# Altium schematic sheet LPCB222 - LINEAR POT.SchDoc
size A3; Address1: Factory 10; Address2: 9-13 Dingley Avenue, Dandeong, VICTORIA 3175, AUSTRALIA; DocumentNumber: 2; Revision: 1; SheetNumber: 2; SheetTotal: 3; Lockie__PCB_SUB_ASSEMBLY: Linear Pot; Lockie__PCB_ASSEMBLY: Gimbal Interface; Lockie__LDL: LPCB222; Lockie__PCB_DESCRIPTION: Gimbal Interface
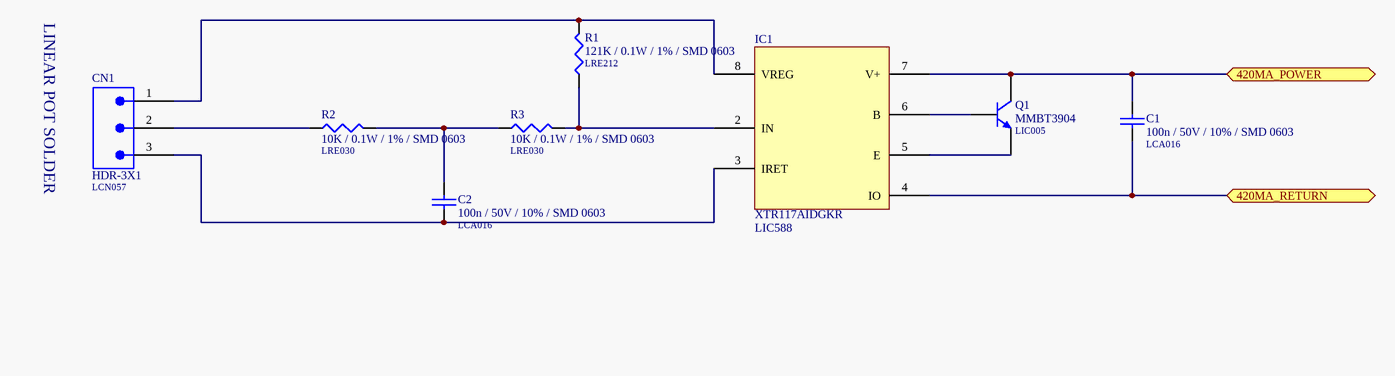
[diagram p0: LPCB222 - LINEAR POT.SchDoc]

## Parts
C1  100n / 50V / 10% / SMD 0603  LDL_NUMBER: LCA016  [LFP011__CC1608-0603-IPC7351_B]
C2  100n / 50V / 10% / SMD 0603  LDL_NUMBER: LCA016  [LFP011__CC1608-0603-IPC7351_B]
CN1  HDR-3X1  LDL_NUMBER: LCN057  [HDR-3X1]  (no BOM)
IC1  XTR117AIDGKR  LDL_NUMBER: LIC588  [LFP015__UMAX8]
Q1  MMBT3904  LDL_NUMBER: LIC005  [LFP021__SOT23]
R1  121K / 0.1W / 1% / SMD 0603  LDL_NUMBER: LRE212  [LFP020__CR1608-0603-IPC7351_B]
R2  10K / 0.1W / 1% / SMD 0603  LDL_NUMBER: LRE030  [LFP020__CR1608-0603-IPC7351_B]
R3  10K / 0.1W / 1% / SMD 0603  LDL_NUMBER: LRE030  [LFP020__CR1608-0603-IPC7351_B]

## Ports
420MA_POWER (bidir), 420MA_RETURN (bidir)

## Nets
420MA_POWER: C1.1 IC1.7(V+) Q1.3(C) ; port 420MA_POWER
420MA_RETURN: C1.2 IC1.4(IO) ; port 420MA_RETURN
NetC2_1: C2.1 R2.2 R3.1
NetC2_2: C2.2 CN1.3 IC1.3(IRET)
NetCN1_1: CN1.1 IC1.8(VREG) R1.2
NetCN1_2: CN1.2 R2.1
NetIC1_2: IC1.2(IN) R1.1 R3.2
NetIC1_5: IC1.5(E) Q1.2(E)
NetIC1_6: IC1.6(B) Q1.1(B)

## Notes on the sheet
- LINEAR POT SOLDER
- PCB COMPONENT DESCRIPTION
- LDL NUMBER
- Assembly Details
- Size
- Drawing File Name
- Revision
- http://rloop.org
- Scale
- A3
- Sheet Details
- N.T.S
- Sheet:
- Of:

## Library data of the parts
C1 C2 = 100n / 50V / 10% / SMD 0603: Capacitor, Ceramic Chip, 100nF (0.1uF), 50V, 5%, SMD 0603 [LCA016]; FMEDA__OPERATING__VOLTAGE_MIN: 0; FMEDA__OPERATING__VOLTAGE_MAX: 3.3; FMEDA__OPERATING__TEMP_MIN: -20; FMEDA__OPERATING__TEMP_TYP: 27; FMEDA__OPERATING__TEMP_MAX: 50; FMEDA__CHANNEL: COM; Value: 100n; FMEDA__FUNCTION_IN_SYSTEM: *; FMEDA__OPERATING__VOLTAGE_TYP: 3.3
CN1 = HDR-3X1: Header, 2.54mm (0.1in), 3 Pins x 1 Row (40 Per Row In Strip); FMEDA__CHANNEL: COM; FMEDA__OPERATING__CURRENT_MAX: 0; FMEDA__OPERATING__TEMP_MAX: 50; FMEDA__OPERATING__TEMP_MIN: -20; FMEDA__OPERATING__TEMP_TYP: 27; FMEDA__OPERATING__VOLTAGE_MAX: 16; FMEDA__OPERATING__VOLTAGE_TYP: 12; FMEDA__FUNCTION_IN_SYSTEM: *; FMEDA__OPERATING__CURRENT_MIN: 0; FMEDA__OPERATING__CURRENT_TYP: 0; FMEDA__OPERATING__VOLTAGE_MIN: 0
IC1 = XTR117AIDGKR: IC, 4-20mA Current Loop Transmitter, SMD SOIC8 [LIC588]
Q1 = MMBT3904: Transistor, NPN, General Purpose, SOT-23 [LIC005]; FMEDA__OPERATING__POWER_MAX: 0; FMEDA__OPERATING__TEMP_MAX: 50; FMEDA__OPERATING__TEMP_MIN: -20; FMEDA__OPERATING__TEMP_TYP: 27; FMEDA__OPERATING__VOLTAGE_MAX: 3.3; FMEDA__CHANNEL: COM; FMEDA__OPERATING__POWER_MIN: 0; FMEDA__OPERATING__POWER_TYP: 0; FMEDA__OPERATING__VOLTAGE_MIN: 0; FMEDA__OPERATING__VOLTAGE_TYP: 3.3; FMEDA__FUNCTION_IN_SYSTEM: *
R1 = 121K / 0.1W / 1% / SMD 0603: Resistor, Ceramic Chip, 121K, 0.1W, SMD 0603 [LRE212]; FMEDA__OPERATING__POWER_MAX: 0; FMEDA__OPERATING__TEMP_MAX: 50; FMEDA__OPERATING__TEMP_MIN: -20; FMEDA__OPERATING__TEMP_TYP: 27; FMEDA__CHANNEL: COM; Value: 121K; FMEDA__OPERATING__POWER_MIN: 0; FMEDA__OPERATING__VOLTAGE_MAX: 0; FMEDA__OPERATING__VOLTAGE_MIN: 0; FMEDA__OPERATING__VOLTAGE_TYP: 0; FMEDA__FUNCTION_IN_SYSTEM: *
R2 R3 = 10K / 0.1W / 1% / SMD 0603: Resistor, Ceramic Chip, 10K, 0.1W, 1%, SMD 0603 [LRE030]; FMEDA__OPERATING__POWER_MAX: 0; FMEDA__OPERATING__TEMP_MAX: 50; FMEDA__OPERATING__TEMP_MIN: -20; FMEDA__OPERATING__TEMP_TYP: 27; FMEDA__CHANNEL: COM; Value: 10K; FMEDA__OPERATING__POWER_MIN: 0; FMEDA__OPERATING__VOLTAGE_MAX: 0; FMEDA__OPERATING__VOLTAGE_MIN: 0; FMEDA__OPERATING__VOLTAGE_TYP: 0; FMEDA__FUNCTION_IN_SYSTEM: *